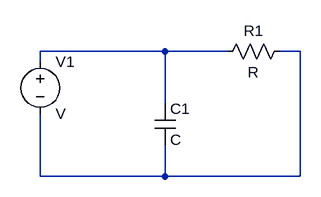
[diagram p0: schematic Draft42.asc]
Draft42.asc, the LTspice schematic file:
Version 4
SHEET 1 880 680
WIRE 224 96 32 96
WIRE 320 96 224 96
WIRE 432 96 400 96
WIRE 32 112 32 96
WIRE 224 176 224 96
WIRE 32 288 32 192
WIRE 224 288 224 240
WIRE 224 288 32 288
WIRE 432 288 432 96
WIRE 432 288 224 288
SYMBOL cap 208 176 R0
SYMATTR InstName C1
SYMBOL res 416 80 R90
WINDOW 0 0 56 VBottom 2
WINDOW 3 32 56 VTop 2
SYMATTR InstName R1
SYMBOL voltage 32 96 R0
SYMATTR InstName V1

The netlist it stands for:
* Draft42.asc
C1 N001 N002 C
R1 N002 N001 R
V1 N001 N002 V
.backanno
.end